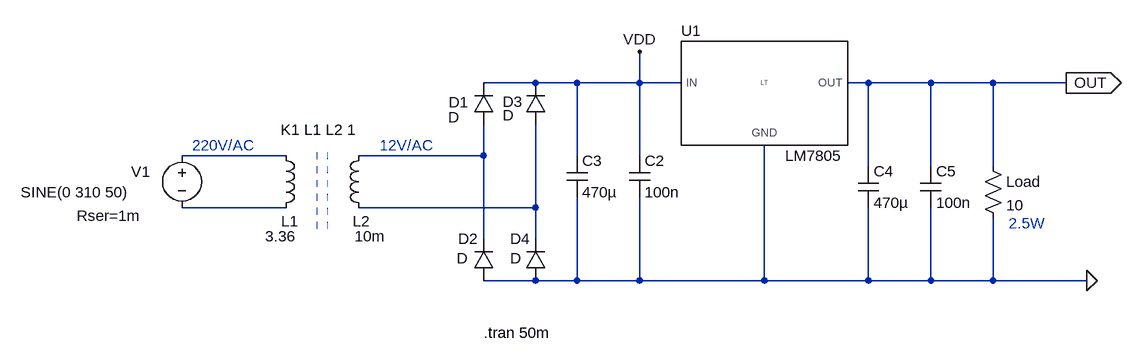
[diagram p0: schematic v2.0.asc]
v2.0.asc, the LTspice schematic file:
Version 4.1
SHEET 1 1736 680
WIRE 368 48 288 48
WIRE 432 48 368 48
WIRE 528 48 528 0
WIRE 528 48 432 48
WIRE 592 48 528 48
WIRE 880 48 848 48
WIRE 976 48 880 48
WIRE 1072 48 976 48
WIRE 1184 48 1072 48
WIRE -16 160 -176 160
WIRE 288 160 288 112
WIRE 288 160 96 160
WIRE 432 160 432 48
WIRE 528 160 528 48
WIRE 880 176 880 48
WIRE 976 176 976 48
WIRE 1072 176 1072 48
WIRE -16 240 -176 240
WIRE 368 240 368 112
WIRE 368 240 96 240
WIRE 288 288 288 160
WIRE 368 288 368 240
WIRE 368 352 288 352
WIRE 432 352 432 224
WIRE 432 352 368 352
WIRE 528 352 528 224
WIRE 528 352 432 352
WIRE 720 352 720 144
WIRE 720 352 528 352
WIRE 880 352 880 240
WIRE 880 352 720 352
WIRE 976 352 976 240
WIRE 976 352 880 352
WIRE 1072 352 1072 256
WIRE 1072 352 976 352
WIRE 1216 352 1072 352
FLAG 1216 352 0
FLAG 528 0 VDD
FLAG 1184 48 OUT
IOPIN 1184 48 Out
SYMBOL voltage -176 144 R0
WINDOW 0 -78 41 Left 2
WINDOW 3 -248 72 Left 2
WINDOW 123 0 0 Left 0
WINDOW 39 -162 108 Left 2
SYMATTR InstName V1
SYMATTR Value SINE(0 310 50)
SYMATTR SpiceLine Rser=1m
SYMBOL diode 304 112 R180
WINDOW 0 39 34 Left 2
WINDOW 3 53 11 Left 2
SYMATTR InstName D1
SYMBOL diode 304 352 R180
WINDOW 0 24 64 Left 2
WINDOW 3 40 34 Left 2
SYMATTR InstName D2
SYMBOL diode 384 112 R180
WINDOW 0 36 35 Left 2
WINDOW 3 49 14 Left 2
SYMATTR InstName D3
SYMBOL diode 384 352 R180
WINDOW 0 24 64 Left 2
WINDOW 3 38 34 Left 2
SYMATTR InstName D4
SYMBOL res 1056 160 R0
SYMATTR InstName Load
SYMATTR Value 10
SYMBOL cap 512 160 R0
SYMATTR InstName C2
SYMATTR Value 100n
SYMBOL cap 416 160 R0
SYMATTR InstName C3
SYMATTR Value 470µ
SYMBOL cap 864 176 R0
SYMATTR InstName C4
SYMATTR Value 470µ
SYMBOL cap 960 176 R0
SYMATTR InstName C5
SYMATTR Value 100n
SYMBOL ind -32 144 R0
WINDOW 0 9 117 Left 2
WINDOW 3 -16 140 Left 2
SYMATTR InstName L1
SYMATTR Value 3.36
SYMATTR Type ind
SYMBOL ind 112 144 M0
WINDOW 0 -2 117 Left 2
WINDOW 3 -25 140 Left 2
SYMATTR InstName L2
SYMATTR Value 10m
SYMATTR Type ind
SYMBOL MyLib\\Regulator\\LM7805 720 48 R0
SYMATTR InstName U1
TEXT 288 432 Left 2 !.tran 50m
TEXT 1096 264 Left 2 ;2.5W
TEXT -24 120 Left 2 !K1 L1 L2 1
TEXT -160 144 Left 2 ;220V/AC
TEXT 128 144 Left 2 ;12V/AC
LINE Normal 32 272 32 144 2
LINE Normal 32 272 32 144 2
LINE Normal 48 272 48 144 2

The netlist it stands for:
* v2.0.asc
V1 N001 N003 SINE(0 310 50) Rser=1m
D1 N002 VDD D
D2 0 N002 D
D3 N004 VDD D
D4 0 N004 D
R§Load OUT 0 10
C2 VDD 0 100n
C3 VDD 0 470µ
C4 OUT 0 470µ
C5 OUT 0 100n
L1 N001 N003 3.36
L2 N002 N004 10m
X§U1 VDD 0 OUT LM7805  ; pins IN GND OUT
.model D D
.lib standard.dio
.tran 50m
* 2.5W
K1 L1 L2 1
* 220V/AC
* 12V/AC
.lib MyLib/Regulator/LM7805.lib
.backanno
.end

* Results of the author's LTspice run, read from the files saved beside the schematic
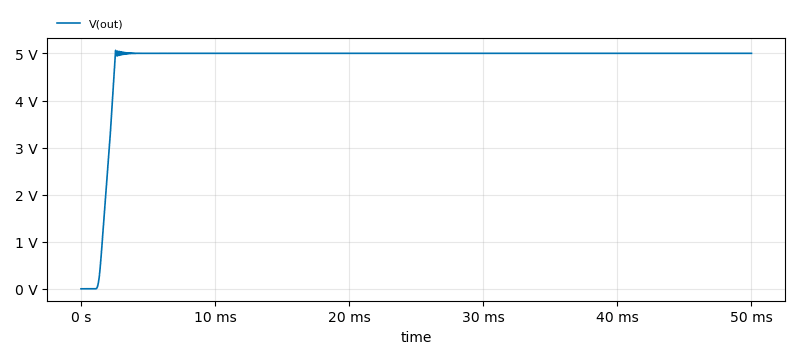
[diagram p1: Transient Analysis of v2.0.asc, plotted from the saved traces]
* Transient Analysis, 1 run:
*   V(out): min 0 V, max 5.065 V, average 4.806 V, rms 4.892 V, last 5.002 V